# EAGLE design 6thapril eagle2 (EAGLE 7.5.0)
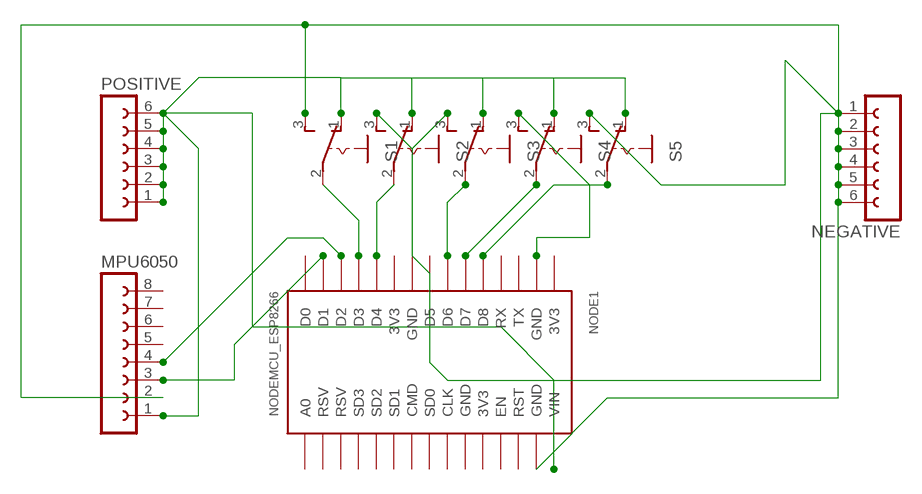
[diagram p0: schematic, sheet 1]

## Parts
MPU6050  FE08-1  [FE08]
NEGATIVE  FE06-1  [FE06]
NODE1  NODEMCU_ESP8266  [NODEMCU_ESP8266]
POSITIVE  FE06-1  [FE06]
S1  255SB  [255SB]
S2  255SB  [255SB]
S3  255SB  [255SB]
S4  255SB  [255SB]
S5  255SB  [255SB]

## Nets
N$1: NODE1.D3 S1.2(P)
N$2: NODE1.D4 S2.2(P)
N$3: NODE1.D6 S3.2(P)
N$4: NODE1.D7 S4.2(P)
N$5: NODE1.D8 S5.2(P)
N$6: MPU6050.2 NEGATIVE.1 NEGATIVE.2 NEGATIVE.3 NEGATIVE.4 NEGATIVE.5 NEGATIVE.6 NODE1.GND@2(GND) NODE1.GND@4(GND) S1.3(S) S2.3(S) S3.3(S) S5.3(S)
N$7: MPU6050.1 NODE1.VIN POSITIVE.1 POSITIVE.2 POSITIVE.3 POSITIVE.4 POSITIVE.5 POSITIVE.6 S1.1(O) S2.1(O) S3.1(O) S4.1(O) S5.1(O)
N$8: NODE1.GND@1(GND) S4.3(S)
N$10: MPU6050.3 NODE1.D1
N$11: MPU6050.4 NODE1.D2
Unconnected: MPU6050.5 MPU6050.6 MPU6050.7 MPU6050.8 NODE1.A0 NODE1.CLK NODE1.CMD NODE1.D0 NODE1.D5 NODE1.EN NODE1.RST NODE1.RSV1(RSV) NODE1.RSV2(RSV) NODE1.RX NODE1.SD1 NODE1.SD2 NODE1.SD3 NODE1.SDO(SD0) NODE1.TX

## Power pins joined to a net without a drawn wire
3V3: NODE1.3V3@1(3V3) NODE1.3V3@2(3V3) NODE1.3V3@3(3V3)
GND: NODE1.GND@3(GND)

## Library data of the parts
MPU6050 = con-lsta:FE08-1: FEMALE HEADER; OC_FARNELL: unknown; OC_NEWARK: unknown
NEGATIVE POSITIVE = con-lsta:FE06-1: FEMALE HEADER; OC_FARNELL: unknown; OC_NEWARK: unknown
NODE1 = nodemcu_esp8266:NODEMCU_ESP8266: Node MCU V2 (ESP8266) Created by Harish
S1-S5 = switch:255SB: SLIDING SWITCH Distributor Buerklin, 11G810

## Net classes
0 default: width 1.016 mm, clearance 1.016 mm

## Board
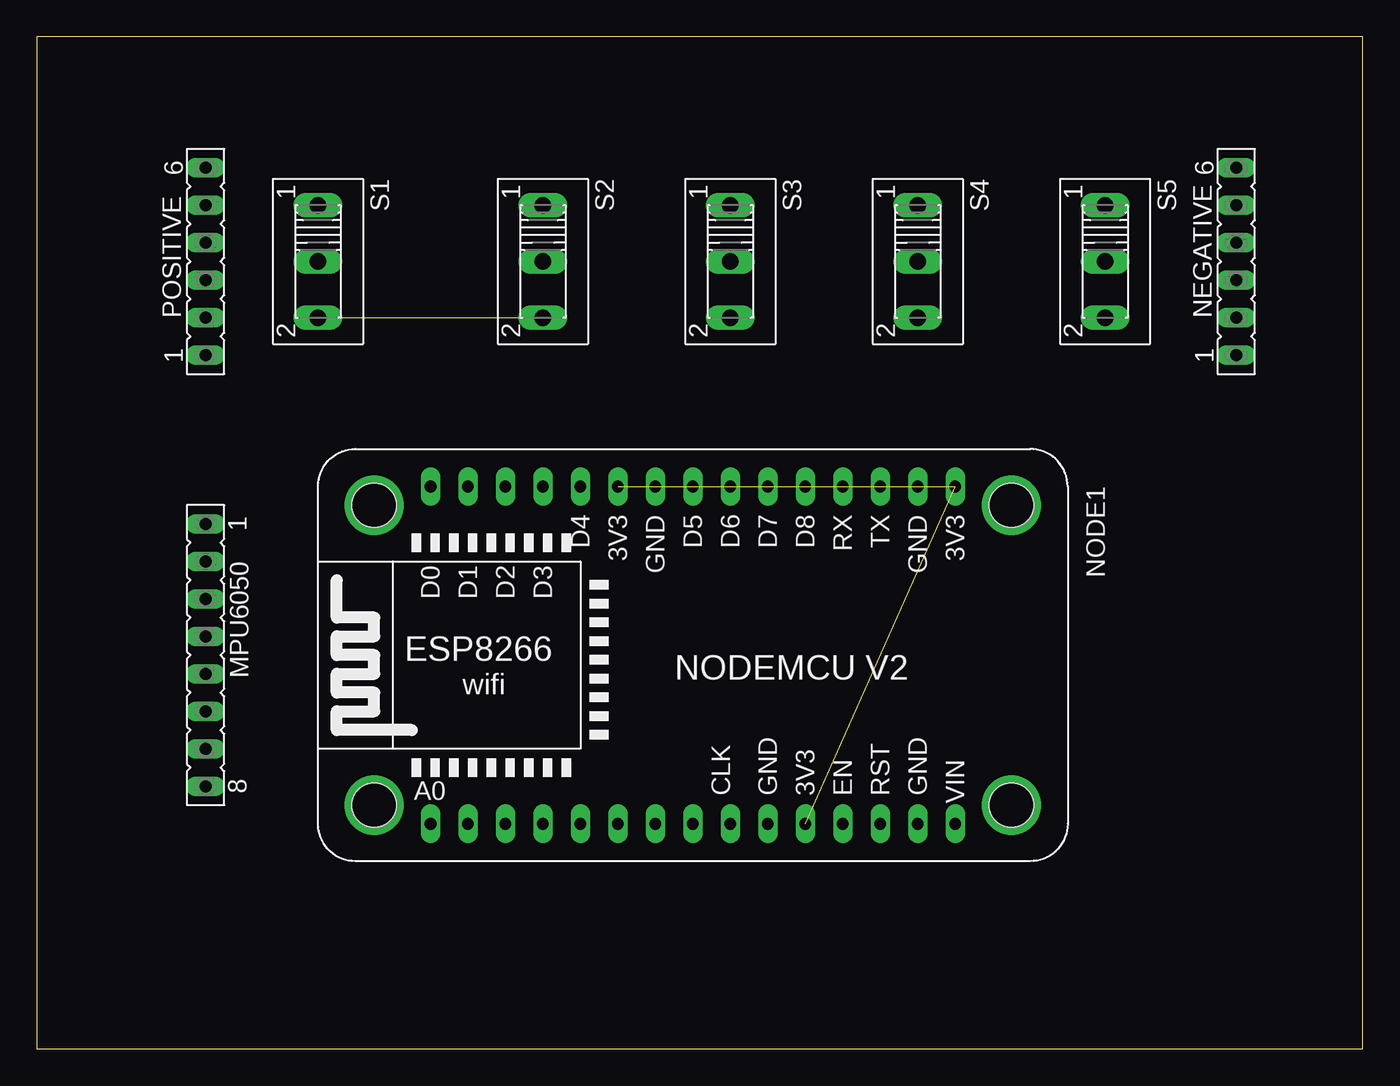
[diagram p1: board, top side]
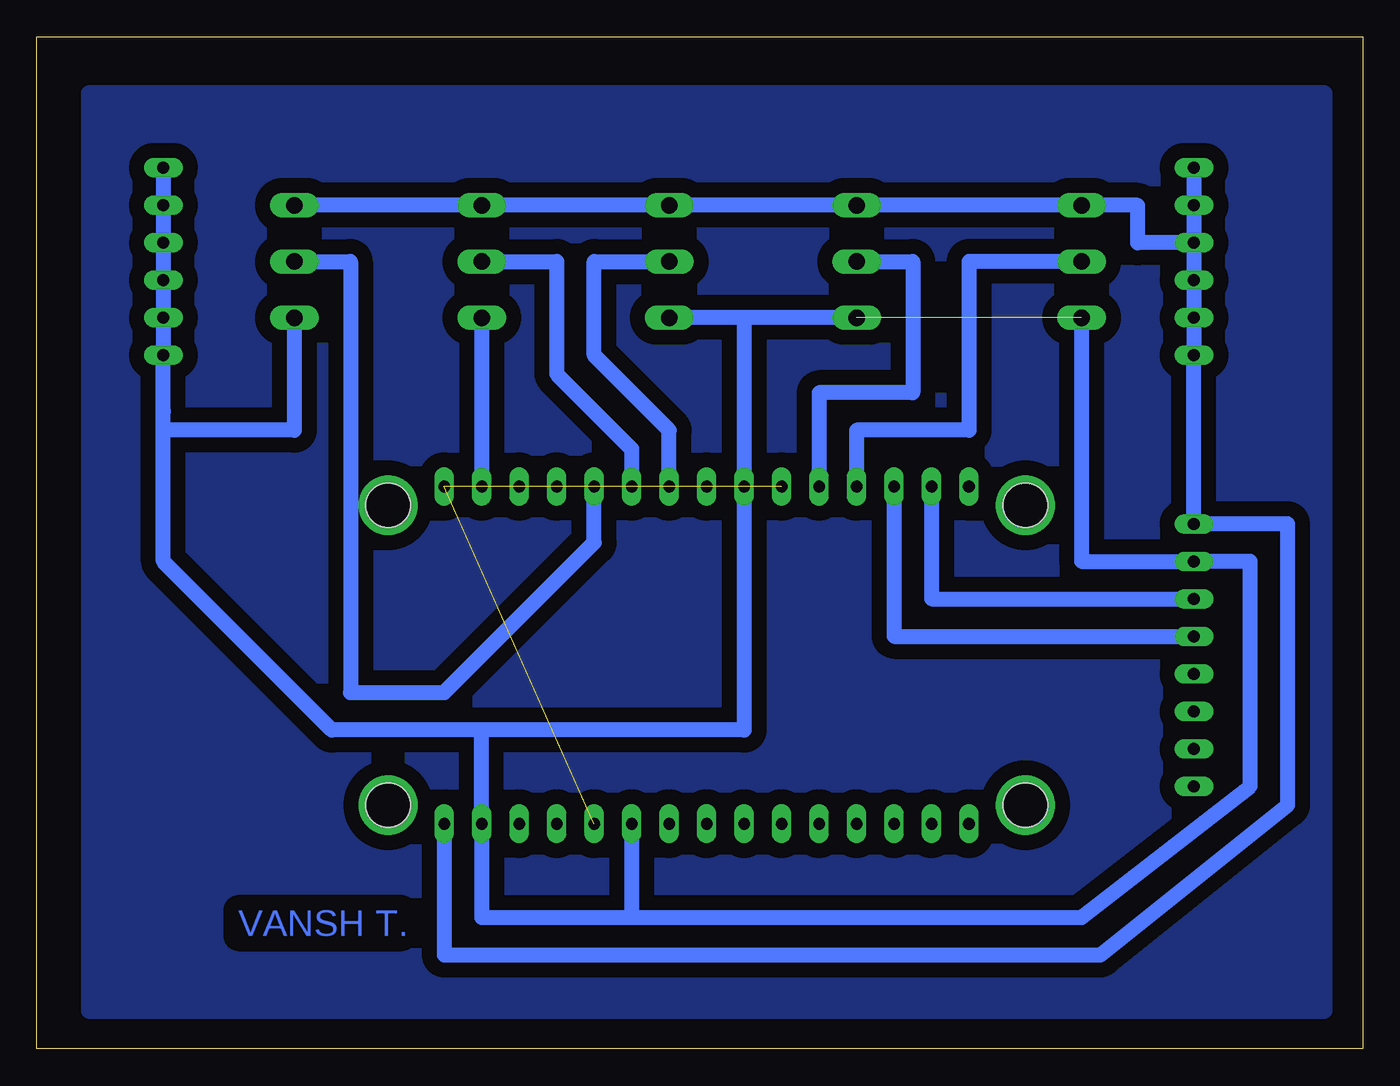
[diagram p2: board, bottom side, seen from below]

Size 89.84 x 68.57 mm. Coordinates in mm from the lower left corner, seen from the top.
Outline: 0,0 89.84,0 89.84,68.57 0,68.57 0,0
Copper layers (1*16): Top 0.035mm / dielectric 1.5mm / Bottom 0.035mm
Design rules "default *": minimum track width 10mil, minimum drill 24mil, track to track 40mil, track to pad 40mil, pad to pad 40mil, via to via 40mil, smd to smd 8mil, copper to edge 40mil, drill to drill 8mil, minimum pad ring 10mil, minimum via ring 8mil, stop-mask expansion 4mil, vias tented up to drill 0mil, thermal gap 10mil

### Footprints (pad centres in the part's own frame; a part is rotated, then mirrored left to right if it is on the bottom)
FE08 = drill 0.813 long: 1 -8.89,0; 2 -6.35,0; 3 -3.81,0; 4 -1.27,0; 5 1.27,0; 6 3.81,0; 7 6.35,0; 8 8.89,0
FE06 = drill 0.813 long: 1 -6.35,0; 2 -3.81,0; 3 -1.27,0; 4 1.27,0; 5 3.81,0; 6 6.35,0
NODEMCU_ESP8266 = drill 0.8 long: 3V3@1 -11.43,19.05; 3V3@2 -11.43,-3.81; 3V3@3 11.43,8.89; A0 11.43,-16.51; CLK 11.43,3.81; CMD 11.43,-1.27; D0 -11.43,-16.51; D1 -11.43,-13.97; D2 -11.43,-11.43; D3 -11.43,-8.89; D4 -11.43,-6.35; D5 -11.43,1.27; D6 -11.43,3.81; D7 -11.43,6.35; D8 -11.43,8.89; EN 11.43,11.43; GND@1 -11.43,16.51; GND@2 -11.43,-1.27; GND@3 11.43,6.35; GND@4 11.43,16.51; RST 11.43,13.97; RSV1 11.43,-11.43; RSV2 11.43,-13.97; RX -11.43,11.43; SD1 11.43,-3.81; SD2 11.43,-6.35; SD3 11.43,-8.89; SDO 11.43,1.27; TX -11.43,13.97; VIN 11.43,19.05 | drill 3: P$31 10.16,22.86; P$32 -10.16,22.86; P$33 -10.16,-20.32; P$34 10.16,-20.32 | hole 3: 10.16,22.86; 10.16,-20.32; -10.16,-20.32; -10.16,22.86
255SB = drill 1.118 long: 1 -3.81,0; 2 0,0; 3 3.81,0

### Placement (x,y rotation side)
MPU6050  11.43,26.67 270 top
NEGATIVE  81.28,53.34 90 top
NODE1  43.18,26.67 270 top
POSITIVE  11.43,53.34 90 top
S1  19.05,53.34 270 top
S2  34.29,53.34 270 top
S3  46.99,53.34 270 top
S4  59.69,53.34 270 top
S5  72.39,53.34 270 top

### Tracks (layer width: path | path; a pad name or v marks a point on that pad's centre or on a via)
3V3  (2 unrouted)
GND
  Bottom 1.016: NODE1.GND@3 49.53,8.89 | 49.53,8.89 19.05,8.89 7.62,17.78 7.62,33.02 11.43,33.02 | 59.69,8.89 49.53,8.89
N$1
  Bottom 1.016: S1.2 26.67,53.34 26.67,41.91 34.29,41.91 NODE1.D3
N$2
  Bottom 1.016: S2.2 30.48,53.34 30.48,44.45 36.83,44.45 NODE1.D4
N$3
  Bottom 1.016: NODE1.D6 46.99,41.91 52.07,46.99 52.07,53.34 S3.2
N$4
  Bottom 1.016: S4.2 54.61,53.34 54.61,45.72 49.53,40.64 NODE1.D7
N$5
  Bottom 1.016: S5.2 68.58,53.34 68.58,24.13 62.23,24.13 52.07,34.29 NODE1.D8
N$6  (1 unrouted)
  Bottom 1.016: S2.3 41.91,49.53 | 41.91,49.53 NODE1.GND@2 41.91,21.59 59.69,21.59 | 41.91,49.53 S3.3 | NEGATIVE.6 NEGATIVE.5 NEGATIVE.4 NEGATIVE.3 NEGATIVE.2 NEGATIVE.1 81.28,43.18 81.28,41.91 | S1.3 19.05,33.02 MPU6050.2 | S5.3 72.39,41.91 81.28,41.91 | 59.69,8.89 NODE1.GND@4 59.69,21.59 | 59.69,21.59 69.85,21.59 81.28,33.02 81.28,41.91
N$7
  Bottom 1.016: NODE1.VIN 62.23,6.35 17.78,6.35 5.08,16.51 5.08,35.56 MPU6050.1 POSITIVE.1 POSITIVE.2 POSITIVE.3 POSITIVE.4 | POSITIVE.6 POSITIVE.5 POSITIVE.4 | POSITIVE.4 15.24,54.61 15.24,57.15 S1.1 S2.1 S3.1 S4.1 S5.1
N$8
  Bottom 1.016: S4.3 NODE1.GND@1
N$9
  pour Bottom: 2.54,2.54 2.54,64.77 86.36,64.77 86.36,63.5 86.36,2.54
N$10
  Bottom 1.016: NODE1.D1 29.21,30.48 MPU6050.3
N$11
  Bottom 1.016: NODE1.D2 31.75,27.94 MPU6050.4

### Text on the board
Bottom: VANSH T.